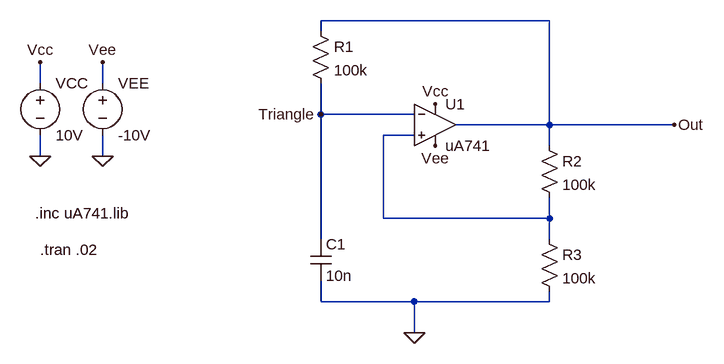
[diagram p0: schematic 4_8a.asc]
4_8a.asc, the LTspice schematic file:
Version 4
SHEET 1 940 680
WIRE 688 -80 336 -80
WIRE 336 -64 336 -80
WIRE -96 16 -96 -16
WIRE 0 16 0 -16
WIRE 336 64 336 16
WIRE 480 64 336 64
WIRE 688 80 688 -80
WIRE 688 80 544 80
WIRE 880 80 688 80
WIRE 480 96 432 96
WIRE 688 112 688 80
WIRE -96 128 -96 96
WIRE 0 128 0 96
WIRE 432 224 432 96
WIRE 688 224 688 192
WIRE 688 224 432 224
WIRE 336 256 336 64
WIRE 688 256 688 224
WIRE 336 352 336 320
WIRE 480 352 336 352
WIRE 688 352 688 336
WIRE 688 352 480 352
WIRE 480 400 480 352
FLAG -96 128 0
FLAG 0 128 0
FLAG -96 -16 Vcc
FLAG 0 -16 Vee
FLAG 512 48 Vcc
FLAG 512 112 Vee
FLAG 480 400 0
FLAG 880 80 Out
FLAG 336 64 Triangle
SYMBOL voltage -96 0 R0
WINDOW 123 0 0 Left 0
WINDOW 39 0 0 Left 0
SYMATTR InstName VCC
SYMATTR Value 10V
SYMBOL voltage 0 0 R0
WINDOW 123 0 0 Left 0
WINDOW 39 0 0 Left 0
SYMATTR InstName VEE
SYMATTR Value -10V
SYMBOL OpAmps\\opamp2 512 16 R0
SYMATTR InstName U1
SYMATTR Value uA741
SYMBOL res 320 -80 R0
SYMATTR InstName R1
SYMATTR Value 100k
SYMBOL res 672 96 R0
SYMATTR InstName R2
SYMATTR Value 100k
SYMBOL res 672 240 R0
SYMATTR InstName R3
SYMATTR Value 100k
SYMBOL cap 320 256 R0
SYMATTR InstName C1
SYMATTR Value 10n
TEXT -104 216 Left 2 !.inc uA741.lib
TEXT -96 272 Left 2 !.tran .02

The netlist it stands for:
* 4_8a.asc
VCC Vcc 0 10V
VEE Vee 0 -10V
XU1 N001 Triangle Vcc Vee Out uA741  ; pins In+ In- V+ V- OUT
R1 Out Triangle 100k
R2 Out N001 100k
R3 N001 0 100k
C1 Triangle 0 10n
.inc uA741.lib
.tran .02
.backanno
.end